# Altium schematic sheet ETH_SWITCH.SchDoc
size 594 x 420 mm; PageSetup: Record=PageOptions|CenterHorizontal=True|CenterVertical=True|PrintScale=0.94|XCorrection=1.00|YCorrection=1.00|PrintKind=1|BorderSize=5000000|LeftOffset=0|BottomOffset=0|Orientation=1|PaperLength=1000|PaperWidth=1000|Scale=100|PaperSource=7|PrintQuality=-4|MediaType=1|DitherType=10|PaperKind=A4|PrintScaleMode=1; Address1: Address1; Address2: Address2; Address3: Address3; Address4: Address4; Перв_применение: Э3
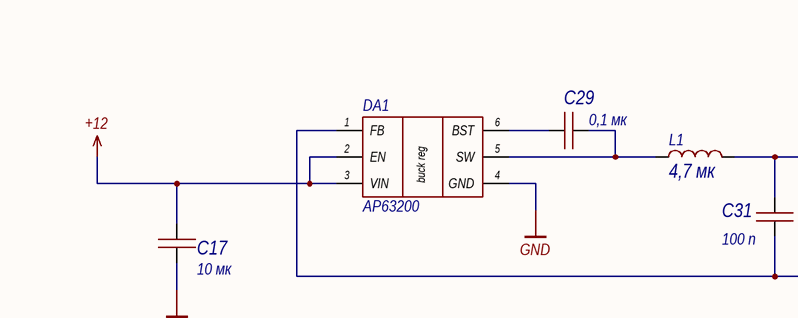
[diagram p0: ETH_SWITCH.SchDoc, top left]
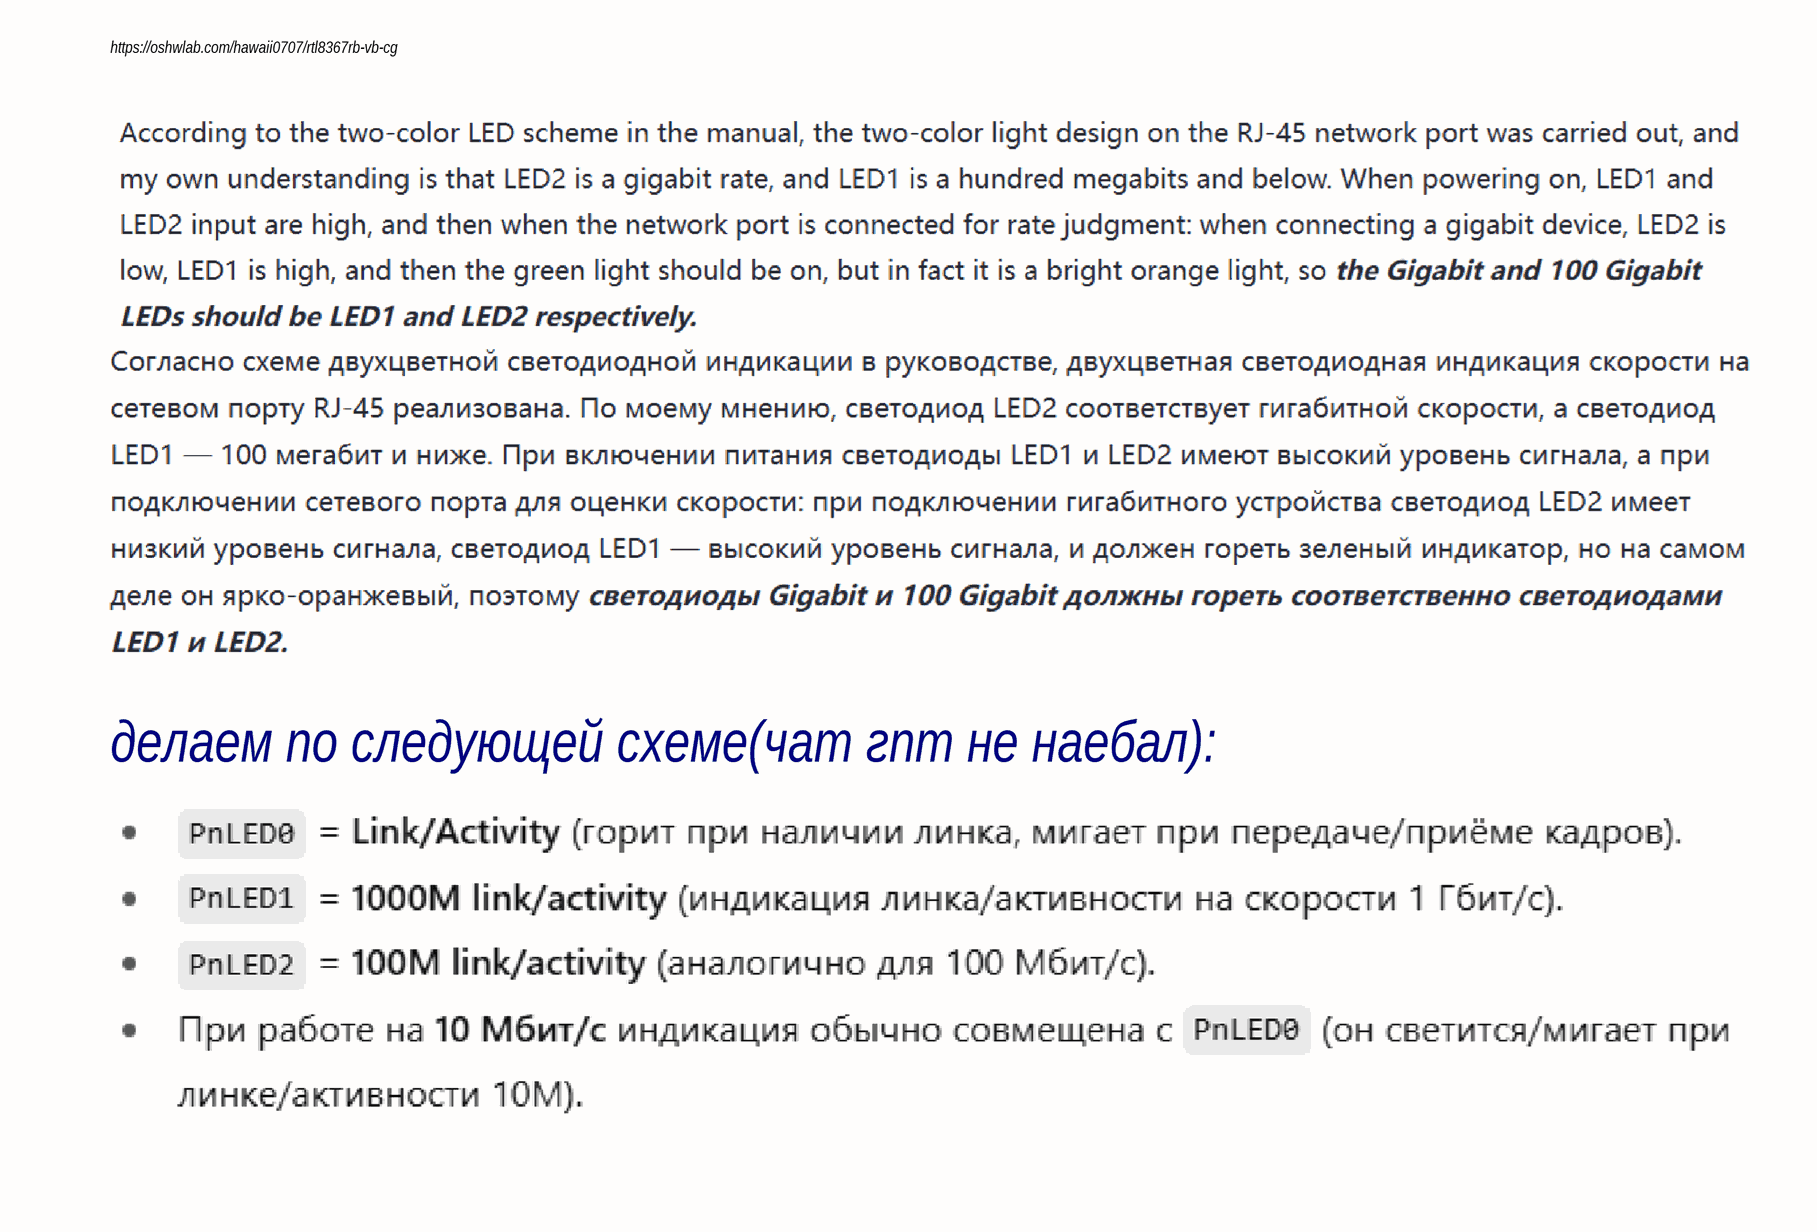
[diagram p1: ETH_SWITCH.SchDoc, top right]
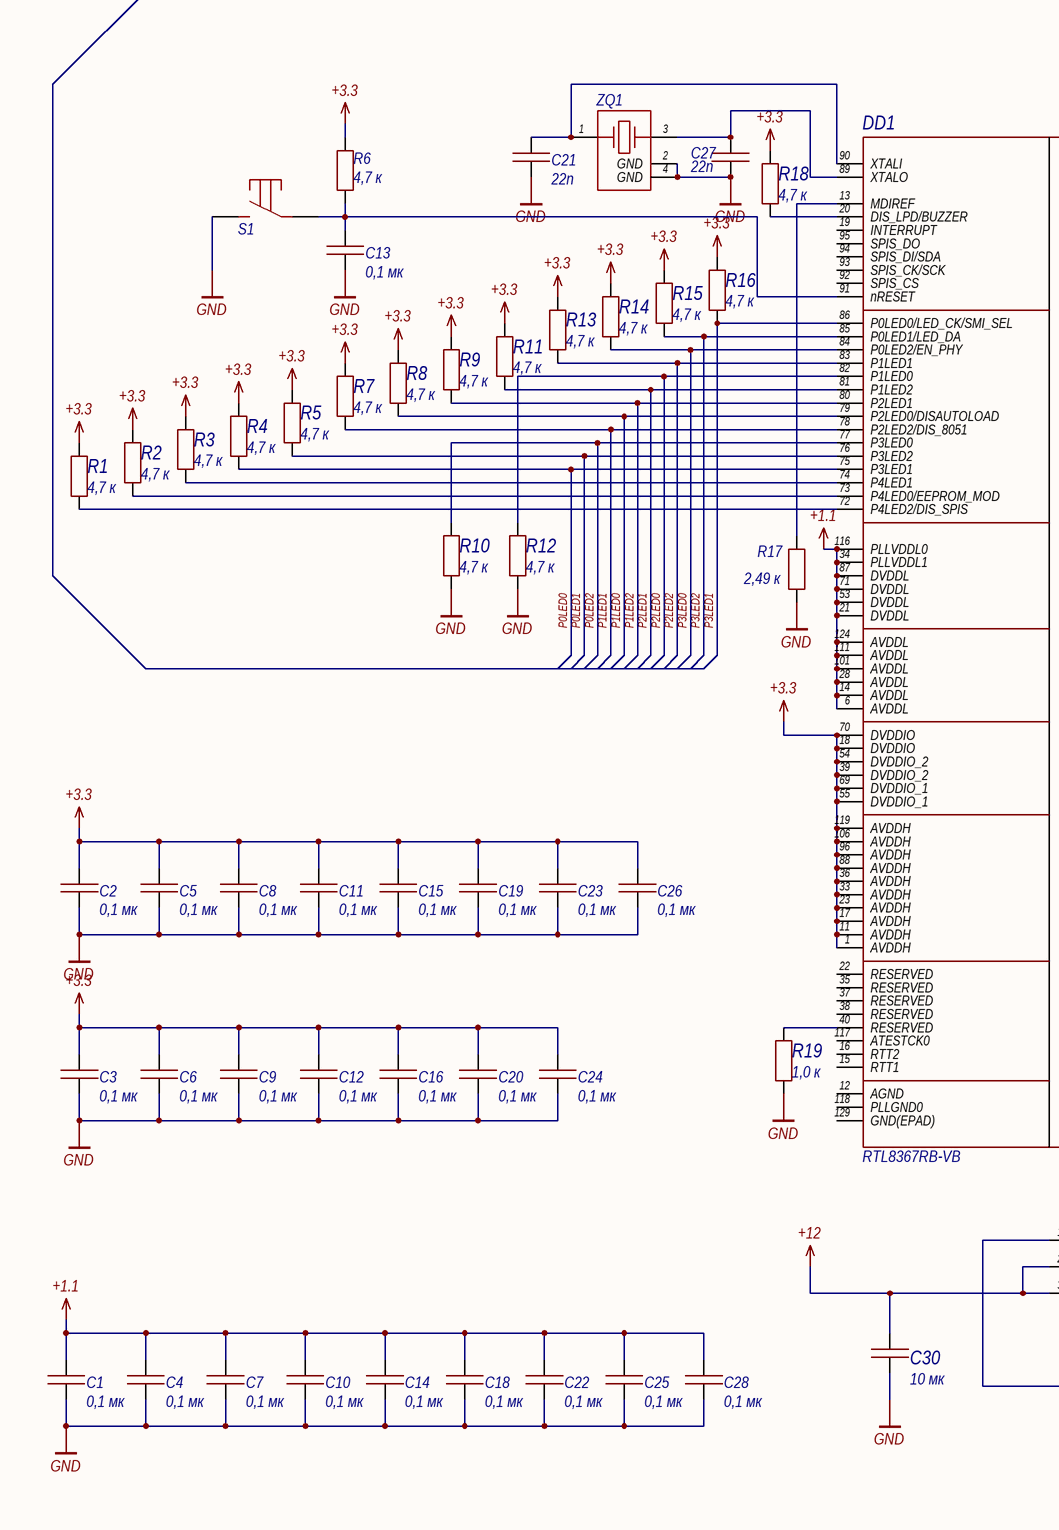
[diagram p2: ETH_SWITCH.SchDoc, bottom left]
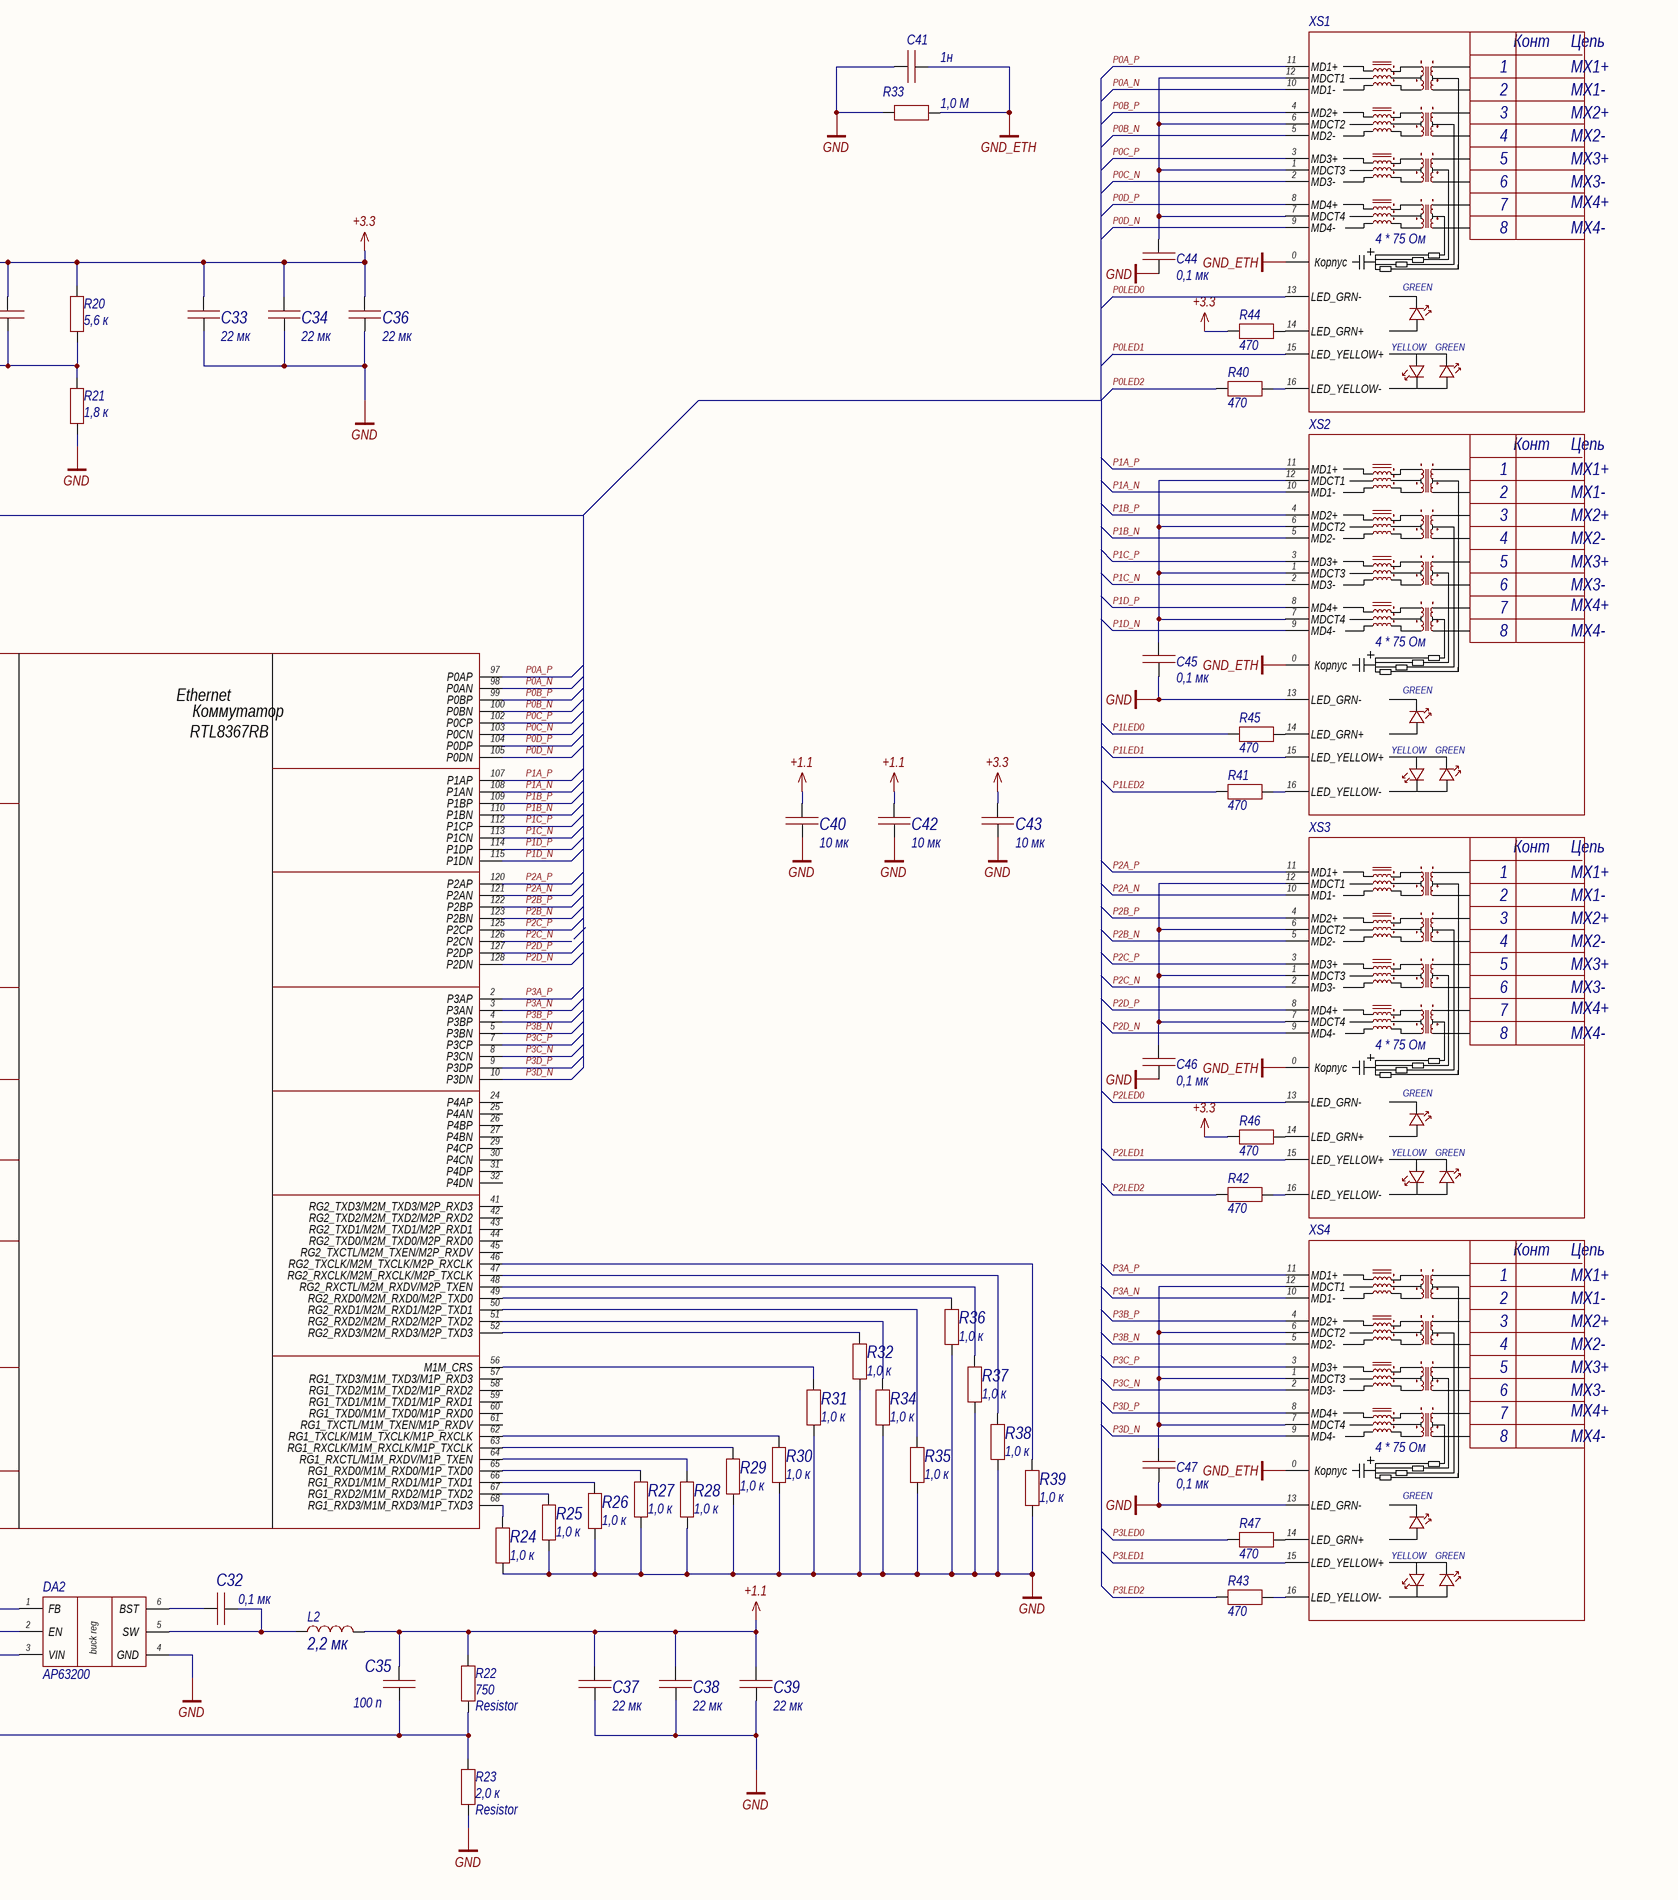
[diagram p3: ETH_SWITCH.SchDoc, bottom right]

## Parts
C1  value 0,1 мк  [0402C]  (hidden comment: Capacitor)
C2  value 0,1 мк  [0402C]  (hidden comment: Capacitor)
C3  value 0,1 мк  [0402C]  (hidden comment: Capacitor)
C4  value 0,1 мк  [0402C]  (hidden comment: Capacitor)
C5  value 0,1 мк  [0402C]  (hidden comment: Capacitor)
C6  value 0,1 мк  [0402C]  (hidden comment: Capacitor)
C7  value 0,1 мк  [0402C]  (hidden comment: Capacitor)
C8  value 0,1 мк  [0402C]  (hidden comment: Capacitor)
C9  value 0,1 мк  [0402C]  (hidden comment: Capacitor)
C10  value 0,1 мк  [0402C]  (hidden comment: Capacitor)
C11  value 0,1 мк  [0402C]  (hidden comment: Capacitor)
C12  value 0,1 мк  [0402C]  (hidden comment: Capacitor)
C13  value 0,1 мк  [0603C]  (hidden comment: Capacitor)
C14  value 0,1 мк  [0402C]  (hidden comment: Capacitor)
C15  value 0,1 мк  [0402C]  (hidden comment: Capacitor)
C16  value 0,1 мк  [0402C]  (hidden comment: Capacitor)
C17  value 10 мк  [1210C]  (hidden comment: Capacitor)
C18  value 0,1 мк  [0402C]  (hidden comment: Capacitor)
C19  value 0,1 мк  [0402C]  (hidden comment: Capacitor)
C20  value 0,1 мк  [0402C]  (hidden comment: Capacitor)
C21  value 22п  [0603C]  (hidden comment: GRM1885C1H220J)
C22  value 0,1 мк  [0402C]  (hidden comment: Capacitor)
C23  value 0,1 мк  [0402C]  (hidden comment: Capacitor)
C24  value 0,1 мк  [0402C]  (hidden comment: Capacitor)
C25  value 0,1 мк  [0402C]  (hidden comment: Capacitor)
C26  value 0,1 мк  [0402C]  (hidden comment: Capacitor)
C27  value 22п  [0603C]  (hidden comment: GRM1885C1H220J)
C28  value 0,1 мк  [0402C]  (hidden comment: Capacitor)
C29  value 0,1 мк  [0603C]  (hidden comment: Capacitor)
C30  value 10 мк  [1210C]  (hidden comment: Capacitor)
C31  value 100 п  [0603C]  (hidden comment: Capacitor)
C32  value 0,1 мк  [0603C]  (hidden comment: Capacitor)
C33  value 22 мк  [1210C]  (hidden comment: Capacitor)
C34  value 22 мк  [1210C]  (hidden comment: Capacitor)
C35  value 100 п  [0603C]  (hidden comment: Capacitor)
C36  value 22 мк  [1210C]  (hidden comment: Capacitor)
C37  value 22 мк  [1210C]  (hidden comment: Capacitor)
C38  value 22 мк  [1210C]  (hidden comment: Capacitor)
C39  value 22 мк  [1210C]  (hidden comment: Capacitor)
C40  value 10 мк  [1210C]  (hidden comment: Capacitor)
C41  value 1н  [1210C]  (hidden comment: Capacitor)
C42  value 10 мк  [1210C]  (hidden comment: Capacitor)
C43  value 10 мк  [1210C]  (hidden comment: Capacitor)
C44  value 0,1 мк  [0603C]  (hidden comment: Capacitor)
C45  value 0,1 мк  [0603C]  (hidden comment: Capacitor)
C46  value 0,1 мк  [0603C]  (hidden comment: Capacitor)
C47  value 0,1 мк  [0603C]  (hidden comment: Capacitor)
DA1  AP63200  [TSOT26]
DA2  AP63200  [TSOT26]
DD1  RTL8367RB-VB  [LQFP128_14x14_exposed_pad]
L1  value 4,7 мк  [B82462G4]  (hidden comment: B82472G6472M)
L2  value 2,2 мк  [CDRH6D12]  (hidden comment: CDRH6D12NP-2R2NC)
R1  value 4,7 к  [0402R]  (hidden comment: Resistor)
R2  value 4,7 к  [0402R]  (hidden comment: Resistor)
R3  value 4,7 к  [0402R]  (hidden comment: Resistor)
R4  value 4,7 к  [0402R]  (hidden comment: Resistor)
R5  value 4,7 к  [0402R]  (hidden comment: Resistor)
R6  value 4,7 к  [0402R]  (hidden comment: Resistor)
R7  value 4,7 к  [0402R]  (hidden comment: Resistor)
R8  value 4,7 к  [0402R]  (hidden comment: Resistor)
R9  value 4,7 к  [0402R]  (hidden comment: Resistor)
R10  value 4,7 к  [0402R]  (hidden comment: Resistor)
R11  value 4,7 к  [0402R]  (hidden comment: Resistor)
R12  value 4,7 к  [0402R]  (hidden comment: Resistor)
R13  value 4,7 к  [0402R]  (hidden comment: Resistor)
R14  value 4,7 к  [0402R]  (hidden comment: Resistor)
R15  value 4,7 к  [0402R]  (hidden comment: Resistor)
R16  value 4,7 к  [0402R]  (hidden comment: Resistor)
R17  value 2,49 к  [0603R]  (hidden comment: RC0603FR-072K49L)
R18  value 4,7 к  [0402R]  (hidden comment: Resistor)
R19  value 1,0 к  [0402R]  (hidden comment: Resistor)
R20  value 5,6 к  [0603R]  (hidden comment: Resistor)
R21  value 1,8 к  [0603R]  (hidden comment: Resistor)
R22  Resistor  value 750  [0603R]
R23  Resistor  value 2,0 к  [0603R]
R24  value 1,0 к  [0402R]  (hidden comment: Resistor)
R25  value 1,0 к  [0402R]  (hidden comment: Resistor)
R26  value 1,0 к  [0402R]  (hidden comment: Resistor)
R27  value 1,0 к  [0402R]  (hidden comment: Resistor)
R28  value 1,0 к  [0402R]  (hidden comment: Resistor)
R29  value 1,0 к  [0402R]  (hidden comment: Resistor)
R30  value 1,0 к  [0402R]  (hidden comment: Resistor)
R31  value 1,0 к  [0402R]  (hidden comment: Resistor)
R32  value 1,0 к  [0402R]  (hidden comment: Resistor)
R33  value 1,0 М  [0603R]  (hidden comment: Resistor)
R34  value 1,0 к  [0402R]  (hidden comment: Resistor)
R35  value 1,0 к  [0402R]  (hidden comment: Resistor)
R36  value 1,0 к  [0402R]  (hidden comment: Resistor)
R37  value 1,0 к  [0402R]  (hidden comment: Resistor)
R38  value 1,0 к  [0402R]  (hidden comment: Resistor)
R39  value 1,0 к  [0402R]  (hidden comment: Resistor)
R40  value 470  [0402R]  (hidden comment: Resistor)
R41  value 470  [0402R]  (hidden comment: Resistor)
R42  value 470  [0402R]  (hidden comment: Resistor)
R43  value 470  [0402R]  (hidden comment: Resistor)
R44  value 470  [0402R]  (hidden comment: Resistor)
R45  value 470  [0402R]  (hidden comment: Resistor)
R46  value 470  [0402R]  (hidden comment: Resistor)
R47  value 470  [0402R]  (hidden comment: Resistor)
S1  Tact_button  [Button_SMD_6x6]  (value not drawn)
XS1  JK0-0136NL  [JK00136NL]  (value not drawn)
XS2  JK0-0136NL  [JK00136NL]  (value not drawn)
XS3  JK0-0136NL  [JK00136NL]  (value not drawn)
XS4  JK0-0136NL  [JK00136NL]  (value not drawn)
ZQ1  X322525MOB4SI  [X322525MOB4SI]  (value not drawn)

## Nets
+1.1: C1.2 C4.2 C7.2 C10.2 C14.2 C18.2 C22.2 C25.2 C28.2 C35.2 C37.2 C38.2 C39.2 C40.2 C42.2 DD1.6(AVDDL) DD1.14(AVDDL) DD1.21(DVDDL) DD1.28(AVDDL) DD1.34(PLLVDDL1) DD1.53(DVDDL) DD1.71(DVDDL) DD1.87(DVDDL) DD1.101(AVDDL) DD1.111(AVDDL) DD1.116(PLLVDDL0) DD1.124(AVDDL) L2.3 R22.2
+3.3: C2.2 C3.2 C5.2 C6.2 C8.2 C9.2 C11.2 C12.2 C15.2 C16.2 C19.2 C20.2 C23.2 C24.2 C26.2 C31.2 C33.2 C34.2 C36.2 C43.2 DD1.1(AVDDH) DD1.11(AVDDH) DD1.17(AVDDH) DD1.18(DVDDIO) DD1.23(AVDDH) DD1.33(AVDDH) DD1.36(AVDDH) DD1.39(DVDDIO_2) DD1.54(DVDDIO_2) DD1.55(DVDDIO_1) DD1.69(DVDDIO_1) DD1.70(DVDDIO) DD1.88(AVDDH) DD1.96(AVDDH) DD1.106(AVDDH) DD1.119(AVDDH) L1.2 R1.2 R2.2 R3.2 R4.2 R5.2 R6.2 R7.2 R8.2 R9.2 R11.2 R13.2 R14.2 R15.2 R16.2 R18.2 R20.2 R44.1 R46.1
+12: C17.2 C30.2 DA1.2(EN) DA1.3(VIN) DA2.2(EN) DA2.3(VIN)
GND: C1.1 C2.1 C3.1 C4.1 C5.1 C6.1 C7.1 C8.1 C9.1 C10.1 C11.1 C12.1 C13.1 C14.1 C15.1 C16.1 C17.1 C18.1 C19.1 C20.1 C21.1 C22.1 C23.1 C24.1 C25.1 C26.1 C27.2 C28.1 C30.1 C33.1 C34.1 C36.1 C37.1 C38.1 C39.1 C40.1 C41.1 C42.1 C43.1 C44.2 C45.2 C46.2 C47.2 DA1.4(GND) DA2.4(GND) R10.1 R12.1 R17.1 R19.1 R21.1 R23.1 R24.1 R25.1 R26.1 R27.1 R28.1 R29.1 R30.1 R31.1 R32.1 R33.1 R34.1 R35.1 R36.1 R37.1 R38.1 R39.1 S1.2 XS2.13(LED_GRN-) XS4.13(LED_GRN-) ZQ1.2(GND) ZQ1.4(GND)
GND_ETH: C41.2 R33.2 XS1.0(Корпус) XS2.0(Корпус) XS3.0(Корпус) XS4.0(Корпус)
P0A_N: DD1.98(P0AN) XS1.10(MD1-)
P0A_P: DD1.97(P0AP) XS1.11(MD1+)
P0B_N: DD1.100(P0BN) XS1.5(MD2-)
P0B_P: DD1.99(P0BP) XS1.4(MD2+)
P0C_N: DD1.103(P0CN) XS1.2(MD3-)
P0C_P: DD1.102(P0CP) XS1.3(MD3+)
P0D_N: DD1.105(P0DN) XS1.9(MD4-)
P0D_P: DD1.104(P0DP) XS1.8(MD4+)
P0LED0: DD1.75(P3LED1) R4.1 XS1.13(LED_GRN-)
P0LED1: DD1.76(P3LED2) R5.1 XS1.15(LED_YELLOW+)
P0LED2: DD1.77(P3LED0) R10.2 R40.1
P1A_N: DD1.108(P1AN) XS2.10(MD1-)
P1A_P: DD1.107(P1AP) XS2.11(MD1+)
P1B_N: DD1.110(P1BN) XS2.5(MD2-)
P1B_P: DD1.109(P1BP) XS2.4(MD2+)
P1C_N: DD1.113(P1CN) XS2.2(MD3-)
P1C_P: DD1.112(P1CP) XS2.3(MD3+)
P1D_N: DD1.115(P1DN) XS2.9(MD4-)
P1D_P: DD1.114(P1DP) XS2.8(MD4+)
P1LED0: DD1.79(P2LED0/DISAUTOLOAD) R8.1 R45.1
P1LED1: DD1.78(P2LED2/DIS_8051) R7.1 XS2.15(LED_YELLOW+)
P1LED2: DD1.80(P2LED1) R9.1 R41.1
P2A_N: DD1.121(P2AN) XS3.10(MD1-)
P2A_P: DD1.120(P2AP) XS3.11(MD1+)
P2B_N: DD1.123(P2BN) XS3.5(MD2-)
P2B_P: DD1.122(P2BP) XS3.4(MD2+)
P2C_N: DD1.126(P2CN) XS3.2(MD3-)
P2C_P: DD1.125(P2CP) XS3.3(MD3+)
P2D_N: DD1.128(P2DN) XS3.9(MD4-)
P2D_P: DD1.127(P2DP) XS3.8(MD4+)
P2LED0: DD1.82(P1LED0) R12.2 XS3.13(LED_GRN-)
P2LED1: DD1.81(P1LED2) R11.1 XS3.15(LED_YELLOW+)
P2LED2: DD1.83(P1LED1) R13.1 R42.1
P3A_N: DD1.3(P3AN) XS4.10(MD1-)
P3A_P: DD1.2(P3AP) XS4.11(MD1+)
P3B_N: DD1.5(P3BN) XS4.5(MD2-)
P3B_P: DD1.4(P3BP) XS4.4(MD2+)
P3C_N: DD1.8(P3CN) XS4.2(MD3-)
P3C_P: DD1.7(P3CP) XS4.3(MD3+)
P3D_N: DD1.10(P3DN) XS4.9(MD4-)
P3D_P: DD1.9(P3DP) XS4.8(MD4+)
P3LED0: DD1.84(P0LED2/EN_PHY) R14.1 R47.1
P3LED1: DD1.86(P0LED0/LED_CK/SMI_SEL) R16.1 XS4.15(LED_YELLOW+)
P3LED2: DD1.85(P0LED1/LED_DA) R15.1 R43.1
NetC13_2: C13.2 DD1.91(nRESET) R6.1 S1.1
NetC21_2: C21.2 DD1.90(XTALI) ZQ1.1
NetC27_1: C27.1 DD1.89(XTALO) ZQ1.3
NetC29_1: C29.1 DA1.6(BST)
NetC29_2: C29.2 DA1.5(SW) L1.1
NetC31_1: C31.1 DA1.1(FB) R20.1 R21.2
NetC32_1: C32.1 DA2.6(BST)
NetC32_2: C32.2 DA2.5(SW) L2.1
NetC35_1: C35.1 DA2.1(FB) R22.1 R23.2
NetC44_1: C44.1 XS1.1(MDCT3) XS1.6(MDCT2) XS1.7(MDCT4) XS1.12(MDCT1)
NetC45_1: C45.1 XS2.1(MDCT3) XS2.6(MDCT2) XS2.7(MDCT4) XS2.12(MDCT1)
NetC46_1: C46.1 XS3.1(MDCT3) XS3.6(MDCT2) XS3.7(MDCT4) XS3.12(MDCT1)
NetC47_1: C47.1 XS4.1(MDCT3) XS4.6(MDCT2) XS4.7(MDCT4) XS4.12(MDCT1)
NetDD1_13: DD1.13(MDIREF) R17.2
NetDD1_20: DD1.20(DIS_LPD/BUZZER) R18.1
NetDD1_40: DD1.40(RESERVED) R19.2
NetDD1_46: DD1.46(RG2_TXCLK/M2M_TXCLK/M2P_RXCLK) R39.2
NetDD1_47: DD1.47(RG2_RXCLK/M2M_RXCLK/M2P_TXCLK) R38.2
NetDD1_48: DD1.48(RG2_RXCTL/M2M_RXDV/M2P_TXEN) R37.2
NetDD1_49: DD1.49(RG2_RXD0/M2M_RXD0/M2P_TXD0) R36.2
NetDD1_50: DD1.50(RG2_RXD1/M2M_RXD1/M2P_TXD1) R35.2
NetDD1_51: DD1.51(RG2_RXD2/M2M_RXD2/M2P_TXD2) R34.2
NetDD1_52: DD1.52(RG2_RXD3/M2M_RXD3/M2P_TXD3) R32.2
NetDD1_56: DD1.56(M1M_CRS) R31.2
NetDD1_62: DD1.62(RG1_TXCLK/M1M_TXCLK/M1P_RXCLK) R30.2
NetDD1_63: DD1.63(RG1_RXCLK/M1M_RXCLK/M1P_TXCLK) R29.2
NetDD1_64: DD1.64(RG1_RXCTL/M1M_RXDV/M1P_TXEN) R28.2
NetDD1_65: DD1.65(RG1_RXD0/M1M_RXD0/M1P_TXD0) R27.2
NetDD1_66: DD1.66(RG1_RXD1/M1M_RXD1/M1P_TXD1) R26.2
NetDD1_67: DD1.67(RG1_RXD2/M1M_RXD2/M1P_TXD2) R25.2
NetDD1_68: DD1.68(RG1_RXD3/M1M_RXD3/M1P_TXD3) R24.2
NetDD1_72: DD1.72(P4LED2/DIS_SPIS) R1.1
NetDD1_73: DD1.73(P4LED0/EEPROM_MOD) R2.1
NetDD1_74: DD1.74(P4LED1) R3.1
NetR40_2: R40.2 XS1.16(LED_YELLOW-)
NetR41_2: R41.2 XS2.16(LED_YELLOW-)
NetR42_2: R42.2 XS3.16(LED_YELLOW-)
NetR43_2: R43.2 XS4.16(LED_YELLOW-)
NetR44_2: R44.2 XS1.14(LED_GRN+)
NetR45_2: R45.2 XS2.14(LED_GRN+)
NetR46_2: R46.2 XS3.14(LED_GRN+)
NetR47_2: R47.2 XS4.14(LED_GRN+)

Not connected (* = marked no-connect by the designer): DD1 12(AGND) 15(RTT1) 16(RTT2) 19(INTERRUPT) 22(RESERVED) 24(P4AP) 25(P4AN) 26(P4BP) 27(P4BN) 29(P4CP) 30(P4CN) 31(P4DP) 32(P4DN) 35(RESERVED) 37(RESERVED) 38(RESERVED) 41(RG2_TXD3/M2M_TXD3/M2P_RXD3) 42(RG2_TXD2/M2M_TXD2/M2P_RXD2) 43(RG2_TXD1/M2M_TXD1/M2P_RXD1) 44(RG2_TXD0/M2M_TXD0/M2P_RXD0) 45(RG2_TXCTL/M2M_TXEN/M2P_RXDV) 57(RG1_TXD3/M1M_TXD3/M1P_RXD3) 58(RG1_TXD2/M1M_TXD2/M1P_RXD2) 59(RG1_TXD1/M1M_TXD1/M1P_RXD1) 60(RG1_TXD0/M1M_TXD0/M1P_RXD0) 61(RG1_TXCTL/M1M_TXEN/M1P_RXDV) 92(SPIS_CS) 93(SPIS_CK/SCK) 94(SPIS_DI/SDA) 95(SPIS_DO) 117(ATESTCK0) 118(PLLGND0) 129(GND(EPAD))

## Notes on the sheet
- https://oshwlab.com/hawaii0707/rtl8367rb-vb-cg
- делаем по следующей схеме(чат гпт не наебал):
- Перв. примен.
- Справ. №
- Подп. и дата
- Инв. № дубл.
- Взам. инв. №
- Разраб.
- Изм.
- Лист
- № докум.
- Подп.
- Дата
- Лит.
- Масса
- Масштаб
- Пров.
- Т.контр.
- Схема электрическая принципиальная
- Листов
- Инв. № подл.
- Утв.
- Н.контр.
- Копировал
- Формат А2
- (in symbol AP63200) buck reg
- (in symbol JK0-0136NL) Конт; Цепь; MX1+; MX1-; MX2+; MX2-; MX3+; MX3-; MX4+; MX4-; 4 * 75 Ом; GREEN; YELLOW
- (in symbol RTL8367RB-VB) Ethernet; Коммутатор; RTL8367RB

## Library data of the parts
C1-C12 C14-C16 C18-C20 C22-C26 C28 = Capacitor_0,1u_10_16V_X7R_0603C: Конденсатор 0402C ёмкостью 0,1 мк 10%, 16 В, X7R; Voltage (V): 16; Capacity (nF): 100; Автор: rreali; Part Number: Capacitor_0,1u_10_16V_X7R_0603C; Tolerance: 10%; Dielectric: X7R
C13 C29 C32 = Capacitor_0,1u_10_50V_X7R_0603C: Конденсатор 0603C ёмкостью 0,1 мк 10%, 50 В, X7R; Voltage (V): 50; Capacity (nF): 100; Part Number: Capacitor_0,1u_10_50V_X7R_0603C; Tolerance: 10%; Dielectric: X7R
C17 C30 C40 C42 C43 = Capacitor_10u_10_35V_X7R_1210C: Конденсатор 1210C ёмкостью 10 мк 10%, 35 В, X7R; Voltage (V): 35; Capacity (nF): 10000; Part Number: Capacitor_10u_10_35V_X7R_1210C; Tolerance: 10%; Dielectric: X7R
C21 C27 = GRM1885C1H220J: Конденсатор 0603C ёмкостью 22п 5%, 50 В, NP0; Voltage (V): 50; Capacity (nF): 0,022; Автор: rreali; Datasheet: https://cdn.promelec.ru/upload/items/2020/02/18/MURATA_MLCC_catalog_C02E_short_.pdf; Part Number: GRM1885C1H220J; Tolerance: 5%; Dielectric: NP0
C31 C35 = Capacitor_100p_10_50V_X7R_0603C: Конденсатор 0603C ёмкостью 100 п 10%, 50 В, X7R; Voltage (V): 50; Capacity (nF): 0,1; Part Number: Capacitor_100p_10_50V_X7R_0603C; Tolerance: 10%; Dielectric: X7R
C33 C34 C36-C39 = Capacitor_22u_10_25V_X7R_1210C: Конденсатор 1210C ёмкостью 22 мк 10%, 25 В, X7R; Voltage (V): 25; Capacity (nF): 22000; Part Number: Capacitor_22u_10_25V_X7R_1210C; Tolerance: 10%; Dielectric: X7R
C41 = Capacitor_1n_10_1000V_X7R_1206C: Конденсатор 1210C ёмкостью 1н 10%, 1000 В, X7R; Voltage (V): 1000; Capacity (nF): 1; Автор: rreali; Datasheet: https://static.chipdip.ru/lib/245/DOC027245978.pdf; Part Number: Capacitor_1n_10_1000V_X7R_1206C; Tolerance: 10%; Dielectric: X7R
C44-C47 = Capacitor_0,1u_10_50V_X7R_0603C: Конденсатор 0603C ёмкостью 0,1 мк 10%, 50 В, X7R; Library Path2: Schematic\Capacitor.SchLib; Voltage (V): 50; Capacity (nF): 100; Part Number: Capacitor_0,1u_10_50V_X7R_0603C; Tolerance: 10%; Dielectric: X7R
DA1 DA2 = AP63200: DC-DC понижающий преобразователь, Vin: 3.8 - 40 В, adj, 2 А; Part Number: AP63200
DD1 = RTL8367RB-VB: Управляемый коммутатор второго уровня на 5+2 порта 10/100/1000M; Автор: rreali; Part Number: RTL8367RB-VB; Datasheet: https://static.chipdip.ru/lib/518/DOC041518607.pdf
L1 = B82472G6472M: Индуктивность на 4,7 мкГн, номинальный ток 2,5 А; Inductance (μH): 4,7; Current: 2,5 А; Автор: rreali; Part Number: B82472G6472M
L2 = CDRH6D12NP-2R2NC: Индуктивность на 2,2 мкГн, номинальный ток 2,5 А; Inductance (μH): 2,2; Current: 2,5 А; Автор: rreali; Part Number: CDRH6D12NP-2R2NC
R1-R16 R18 = Resistor_4.7k_1_0402: Резистор номиналом 4,7 кОм 1%; Автор: rreali; Power: *; Part Number: Resistor_4.7k_1_0402; Tolerance: 1%
R17 = RC0603FR-072K49L: 0.1Вт 0603 2.49 кОм, 1%, Чип резистор; Автор: rreali; Power: *; Part Number: RC0603FR-072K49L; Tolerance: 1%
R19 R24-R32 R34-R39 = Resistor_1.0k_1_0402: Резистор номиналом 1,0 кОм 1%; Автор: rreali; Power: *; Part Number: Resistor_1.0k_1_0402; Tolerance: 1%
R20 = Resistor_5.6k_1_0603: Резистор номиналом 5,6 кОм 1%; Power: *; Part Number: Resistor_5.6k_1_0603; Tolerance: 1%
R21 = Resistor_1.8k_1_0603: Резистор номиналом 1,8 кОм 1%; Power: *; Part Number: Resistor_1.8k_1_0603; Tolerance: 1%
R22 = Resistor_750_1_0603: Резистор номиналом 750 Ом 1%; Power: *; Part Number: Resistor_750_1_0603; Tolerance: 1%
R23 = Resistor_2.0k_1_0603: Резистор номиналом 2,0 кОм 1%; Power: *; Part Number: Resistor_2.0k_1_0603; Tolerance: 1%
R33 = Resistor_1.0M_1_0603: Резистор номиналом 1,0 МОм 1%; Power: *; Part Number: Resistor_1.0M_1_0603; Tolerance: 1%
R40-R47 = Resistor_470_1_0402: Резистор номиналом 470 Ом 1%; Автор: rreali; Power: *; Part Number: Resistor_470_1_0402; Tolerance: 1%
S1 = Tact_button: Тактовая кнопка; Part Number: Tact_button
XS1-XS4 = JK0-0136NL: Модульный разъем (с трансформатором) Cat5/6, RJ45, Гнездо,  1 порт; MF: Pulse Electronics; System: Connector; Автор: rreali; Mouser-Purchase-URL: https://snapeda.com/shop?store=Mouser&id=195579; Package: None; MP: JK0-0136NL; DigiKey-Purchase-URL: https://snapeda.com/shop?store=DigiKey&id=195579; Value: *; SnapEDA_Link: https://www.snapeda.com/parts/JK0-0136NL/Pulse%20Electronics%20Network/view-part/195579/?ref=snap; Price: None; Availability: Good; Part Number: JK0-0136NL; Datasheet: https://static.chipdip.ru/lib/746/DOC044746386.pdf
ZQ1 = X322525MOB4SI: Кварцевый резонатор SMD 25 МГц ±10ppm SMD-3225_4P; Value: 25 МГц; Автор: rreali; Part Number: X322525MOB4SI; Datasheet: https://datasheet.lcsc.com/lcsc/Yangxing-Tech-X322525MOB4SI_C9006.pdf